# Altium schematic sheet 7_Microcontroller.SchDoc
size A4; SheetNumber: 8; SheetTotal: 8
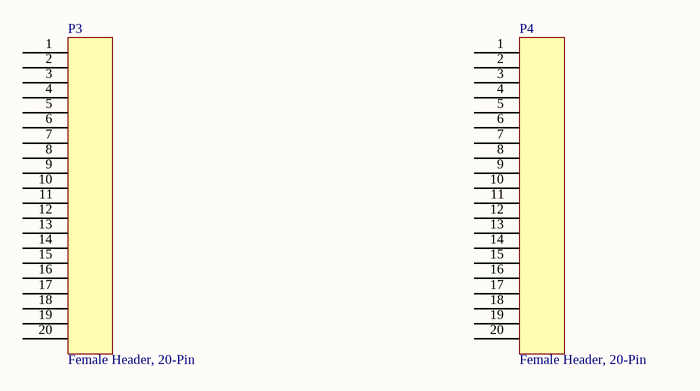
[diagram p0: 7_Microcontroller.SchDoc]

## Parts
P3  Female Header, 20-Pin  [HEADER 20]
P4  Female Header, 20-Pin  [HEADER 20]

## Nets

Not connected (* = marked no-connect by the designer): P3 1 2 3 4 5 6 7 8 9 10 11 12 13 14 15 16 17 18 19 20; P4 1 2 3 4 5 6 7 8 9 10 11 12 13 14 15 16 17 18 19 20

## Library data of the parts
P3 P4 = Header 20